# Altium schematic sheet AIBoard.SchDoc: AI Board
size A4; Author: YIng; Revision: V1.0
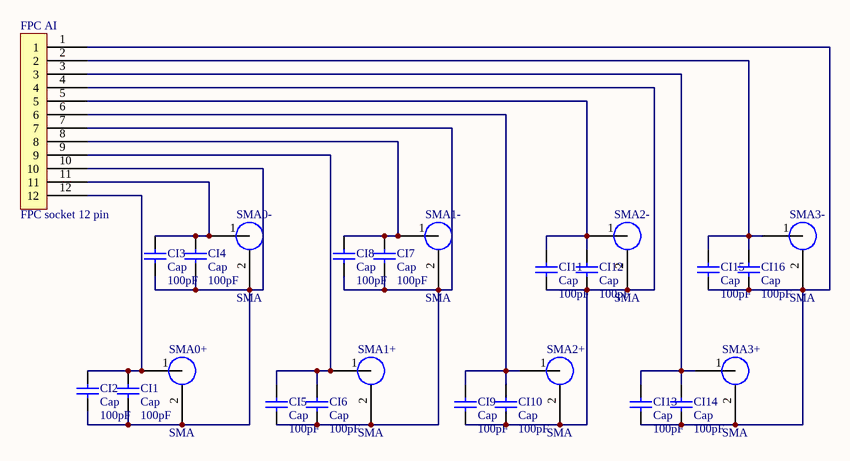
[diagram p0: AIBoard.SchDoc]

## Parts
CI1  Cap  value 100pF  [RAD-0.3]
CI2  Cap  value 100pF  [RAD-0.3]
CI3  Cap  value 100pF  [RAD-0.3]
CI4  Cap  value 100pF  [RAD-0.3]
CI5  Cap  value 100pF  [RAD-0.3]
CI6  Cap  value 100pF  [RAD-0.3]
CI7  Cap  value 100pF  [RAD-0.3]
CI8  Cap  value 100pF  [RAD-0.3]
CI9  Cap  value 100pF  [RAD-0.3]
CI10  Cap  value 100pF  [RAD-0.3]
CI11  Cap  value 100pF  [RAD-0.3]
CI12  Cap  value 100pF  [RAD-0.3]
CI13  Cap  value 100pF  [RAD-0.3]
CI14  Cap  value 100pF  [RAD-0.3]
CI15  Cap  value 100pF  [RAD-0.3]
CI16  Cap  value 100pF  [RAD-0.3]
FPC_AI  FPC socket 12 pin  [FPC 12pin]
SMA0+  SMA  [SMA]
SMA0-  SMA  [SMA]
SMA1+  SMA  [SMA]
SMA1-  SMA  [SMA]
SMA2+  SMA  [SMA]
SMA2-  SMA  [SMA]
SMA3+  SMA  [SMA]
SMA3-  SMA  [SMA]

## Nets
NetCI1_1: CI1.1 CI2.1 CI3.1 CI4.1 FPC_AI.10 SMA0+.2(Ground) SMA0-.2(Ground)
NetCI1_2: CI1.2 CI2.2 FPC_AI.12 SMA0+.1(Core)
NetCI3_2: CI3.2 CI4.2 FPC_AI.11 SMA0-.1(Core)
NetCI5_1: CI5.1 CI6.1 CI7.1 CI8.1 FPC_AI.7 SMA1+.2(Ground) SMA1-.2(Ground)
NetCI5_2: CI5.2 CI6.2 FPC_AI.9 SMA1+.1(Core)
NetCI7_2: CI7.2 CI8.2 FPC_AI.8 SMA1-.1(Core)
NetCI9_1: CI9.1 CI10.1 CI11.1 CI12.1 FPC_AI.4 SMA2+.2(Ground) SMA2-.2(Ground)
NetCI9_2: CI9.2 CI10.2 FPC_AI.6 SMA2+.1(Core)
NetCI11_2: CI11.2 CI12.2 FPC_AI.5 SMA2-.1(Core)
NetCI13_1: CI13.1 CI14.1 CI15.1 CI16.1 FPC_AI.1 SMA3+.2(Ground) SMA3-.2(Ground)
NetCI13_2: CI13.2 CI14.2 FPC_AI.3 SMA3+.1(Core)
NetCI15_2: CI15.2 CI16.2 FPC_AI.2 SMA3-.1(Core)

## Notes on the sheet
- Title
- Size:
- Date:
- A4
- Number:
- Time:
- Revision:
- Sheet
- of
- File:

## Library data of the parts
CI1-CI16 = Cap: Capacitor; Published: 8-Jun-2000; LatestRevisionDate: 17-Jul-2002; LatestRevisionNote: Re-released for DXP Platform.; PackageReference: RAD-0.3; Publisher: Altium Limited; PackageDescription: Radial Cap, Thru-Hole; 2 Leads; 0.3 in Pin Spacing